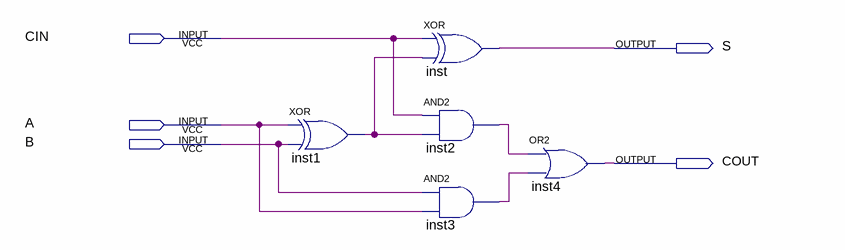
[diagram p0: schematic sheet]
// Quartus schematic HA.bdf as structural Verilog: 5 symbols, 5 pins
module HA (
  input  CIN,
  input  A,
  input  B,
  output S,
  output COUT
);

  wire inst1_out, inst2_out, inst3_out;

  xor inst1 (inst1_out, A, B);
  xor inst (S, CIN, inst1_out);
  and inst2 (inst2_out, CIN, inst1_out);
  and inst3 (inst3_out, B, A);
  or inst4 (COUT, inst2_out, inst3_out);
endmodule
